# Altium schematic sheet Последовательный порт.SchDoc
size 209 x 297 mm; Scale: 1:1; DocumentType: Схема электрическая принципиальная; FirstReferrence: АБВГ.123456.001
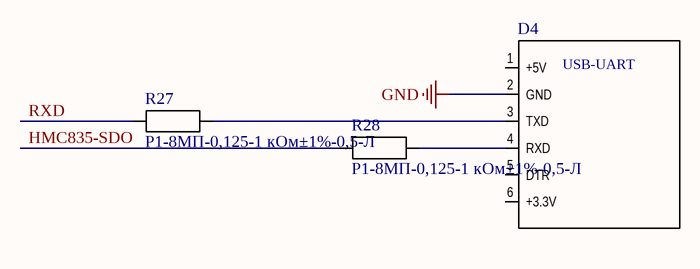
[diagram p0: Последовательный порт.SchDoc]

## Parts
D4  (no value)  [USB-UART-CP2102]
R27  Р1-8МП-0,125-1 кОм±1%-0,5-Л  [Р1-8МП-0,125]
R28  Р1-8МП-0,125-1 кОм±1%-0,5-Л  [Р1-8МП-0,125]

## Nets
GND: D4.2(GND)
HMC835-SDO: R28.1
RXD: R27.1
NetD4_3: D4.3(TXD) R27.2
NetD4_4: D4.4(RXD) R28.2

Not connected (* = marked no-connect by the designer): D4 1(+5V) 5(DTR) 6(+3.3V)

## Notes on the sheet
- Перв. примен.
- Справ. №
- Подп. и дата
- Инв. № дубл.
- Взам. инв. №
- Разраб.
- Изм.
- Лист
- № докум.
- Подп.
- Дата
- Лит.
- Масса
- Масштаб
- Пров.
- Т.контр.
- Листов
- Инв. № подл.
- Утв.
- Н.контр.
- 2.106-A4
- Копировал
- Формат А4

## Library data of the parts
D4 = USB-UART: Manufacturer: China; ManufacturerPartNumber: CJMUC CP2102; Category: Модуль
R27 R28 = Р1-8МП-0,125-1 кОм±1%: PartNumber: ОЖ0.467.164ТУ; Value: 360; Power/Voltage: 0,125; Category: Резистор; Tolerance: ±1%-0,5-Л; ManufacturerPartNumber: Р1-8МП-0,125-1 кОм±1%-0,5-Л